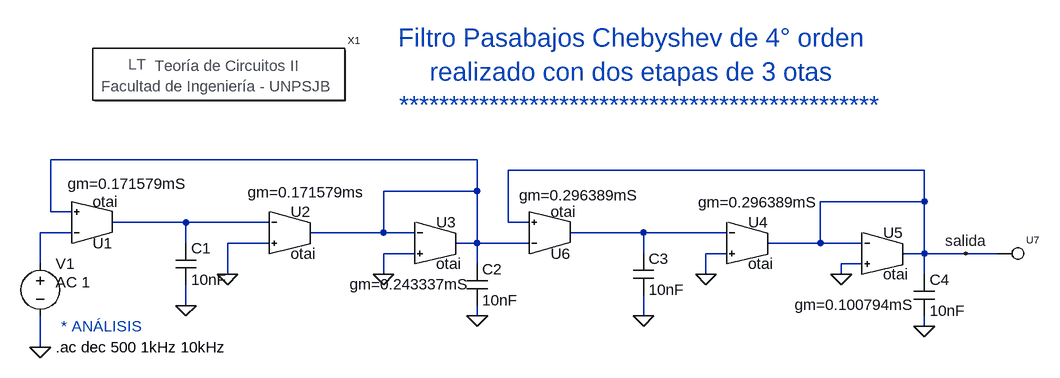
[diagram p0: schematic Filtro Chebyshev de 4 orden con dos etapas de 3 otas.asc]
Filtro Chebyshev de 4 orden con dos etapas de 3 otas.asc, the LTspice schematic file:
Version 4
SHEET 1 1508 680
WIRE 224 -448 -432 -448
WIRE 912 -432 272 -432
WIRE 224 -400 224 -448
WIRE 224 -400 80 -400
WIRE 912 -384 912 -432
WIRE 912 -384 752 -384
WIRE -432 -368 -432 -448
WIRE -400 -368 -432 -368
WIRE -224 -352 -336 -352
WIRE -96 -352 -224 -352
WIRE 272 -352 272 -432
WIRE 304 -352 272 -352
WIRE -400 -336 -448 -336
WIRE 80 -336 80 -400
WIRE 80 -336 -32 -336
WIRE 128 -336 80 -336
WIRE 480 -336 368 -336
WIRE 608 -336 480 -336
WIRE -224 -320 -224 -352
WIRE -96 -320 -160 -320
WIRE 224 -320 224 -400
WIRE 224 -320 192 -320
WIRE 304 -320 224 -320
WIRE 752 -320 752 -384
WIRE 752 -320 672 -320
WIRE 816 -320 752 -320
WIRE 128 -304 80 -304
WIRE 480 -304 480 -336
WIRE 608 -304 576 -304
WIRE 912 -304 912 -384
WIRE 912 -304 880 -304
WIRE 976 -304 912 -304
WIRE 1024 -304 976 -304
WIRE -448 -288 -448 -336
WIRE 224 -288 224 -320
WIRE 816 -288 784 -288
WIRE -160 -272 -160 -320
WIRE 80 -272 80 -304
WIRE 576 -272 576 -304
WIRE 784 -272 784 -288
WIRE 912 -272 912 -304
WIRE -224 -224 -224 -256
WIRE 224 -208 224 -224
WIRE 480 -208 480 -240
WIRE 912 -192 912 -208
WIRE -448 -160 -448 -208
FLAG -448 -160 0
FLAG -224 -224 0
FLAG 224 -208 0
FLAG 80 -272 0
FLAG 480 -208 0
FLAG 912 -192 0
FLAG 784 -272 0
FLAG 976 -304 salida
FLAG -160 -272 0
FLAG 576 -272 0
SYMBOL otai -64 -400 R0
WINDOW 3 -65 2 Left 2
SYMATTR Value gm=0.171579ms
SYMATTR InstName U2
SYMBOL otai 160 -384 R0
WINDOW 3 -132 127 Left 2
SYMATTR Value gm=0.243337mS
SYMATTR InstName U3
SYMBOL otai -368 -288 M180
WINDOW 3 -38 123 Left 2
SYMATTR Value gm=0.171579mS
SYMATTR InstName U1
SYMBOL cap -240 -320 R0
SYMATTR InstName C1
SYMATTR Value 10nF
SYMBOL cap 208 -288 R0
SYMATTR InstName C2
SYMATTR Value 10nF
SYMBOL voltage -448 -304 R0
WINDOW 123 24 44 Left 2
WINDOW 39 0 0 Left 2
SYMATTR Value2 AC 1
SYMATTR InstName V1
SYMATTR Value ""
SYMBOL otai 640 -384 R0
WINDOW 3 -76 1 Left 2
SYMATTR Value gm=0.296389mS
SYMATTR InstName U4
SYMBOL otai 848 -368 R0
WINDOW 3 -135 143 Left 2
SYMATTR Value gm=0.100794mS
SYMATTR InstName U5
SYMBOL otai 336 -272 M180
WINDOW 3 -47 122 Left 2
SYMATTR Value gm=0.296389mS
SYMATTR InstName U6
SYMBOL cap 464 -304 R0
SYMATTR InstName C3
SYMATTR Value 10nF
SYMBOL cap 896 -272 R0
SYMATTR InstName C4
SYMATTR Value 10nF
SYMBOL Circuitos2\\Letreros\\Teoría\ de\ Circuitos\ II -176 -576 R0
SYMATTR InstName X1
SYMBOL Circuitos2\\Borneras\\Borne 1040 -304 R0
SYMATTR InstName U7
TEXT -424 -160 Left 2 !.ac dec 500 1kHz 10kHz
TEXT 464 -584 Center 4 ;Filtro Pasabajos Chebyshev de 4° orden\nrealizado con dos etapas de 3 otas\n************************************************
TEXT -416 -192 Left 2 ;* ANÁLISIS

The netlist it stands for:
* Filtro Chebyshev de 4 orden con dos etapas de 3 otas.asc
XU2 0 N002 N001 otai gm=0.171579ms  ; pins p n s
XU3 0 N001 N001 otai gm=0.243337mS  ; pins p n s
XU1 N001 N003 N002 otai gm=0.171579mS  ; pins p n s
C1 N002 0 10nF
C2 N001 0 10nF
V1 N003 0 AC 1
XU4 0 N004 salida otai gm=0.296389mS  ; pins p n s
XU5 0 salida salida otai gm=0.100794mS  ; pins p n s
XU6 salida N001 N004 otai gm=0.296389mS  ; pins p n s
C3 N004 0 10nF
C4 salida 0 10nF
XX1 Teoría de Circuitos II
XU7 salida borne  ; pins 1
.ac dec 500 1kHz 10kHz
* Filtro Pasabajos Chebyshev de 4° orden
* realizado con dos etapas de 3 otas
* ************************************************
* * ANÁLISIS
.lib ..\sym\Circuitos2\ComponentesIdeales\compoideales.lib
.lib ..\sym\Circuitos2\Borneras\borne.lib
.backanno
.end